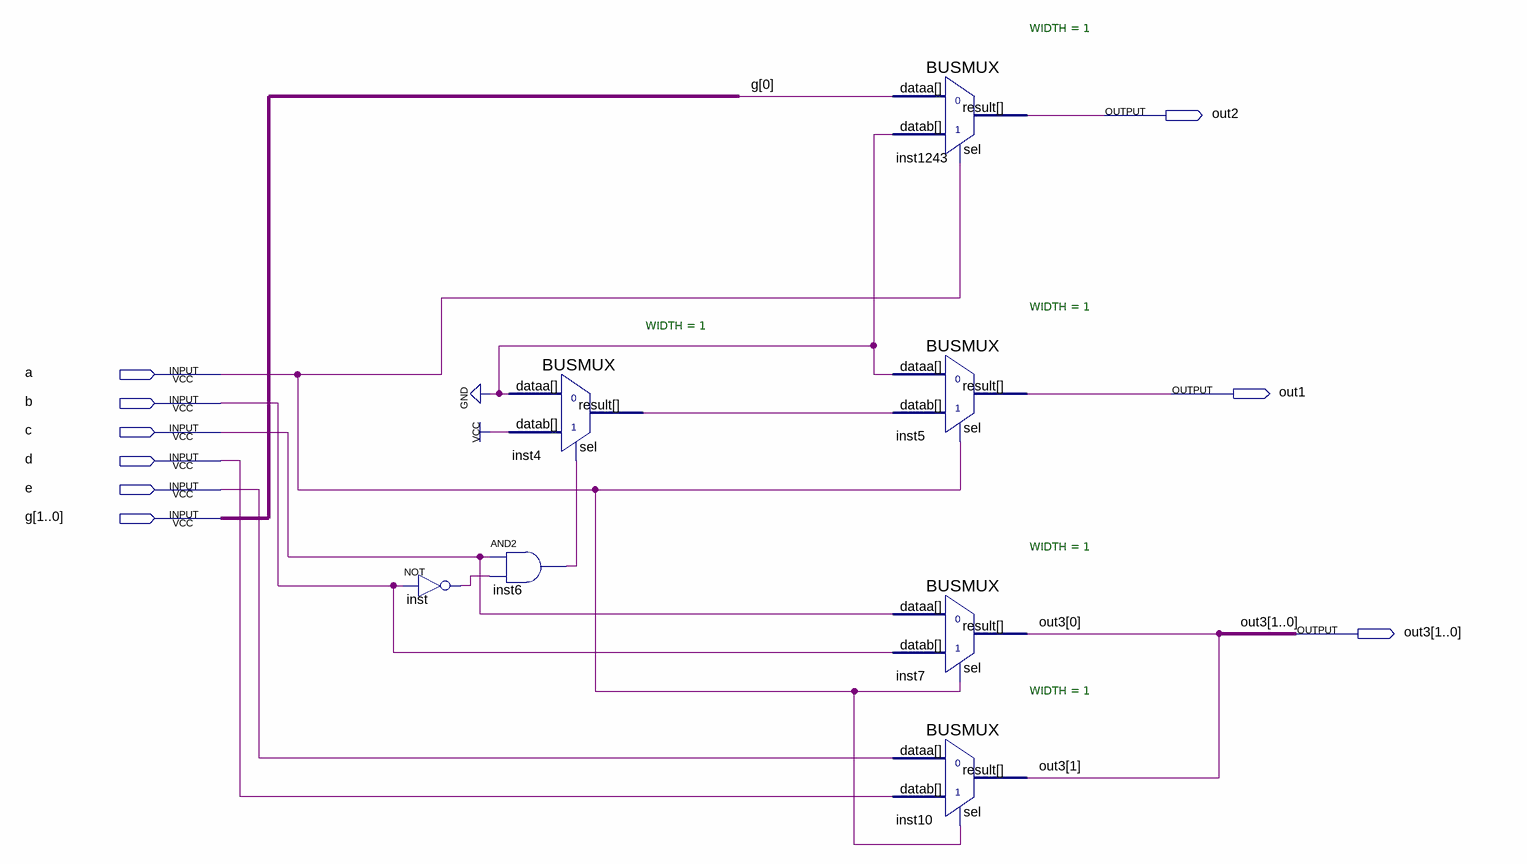
[diagram p0: schematic sheet]
// Quartus schematic Block1.bdf as structural Verilog: 7 symbols, 9 pins
module Block1 (
  input  a,
  input  b,
  input  c,
  input  d,
  input  e,
  input  [1:0] g,
  output out2,
  output out1,
  output [1:0] out3
);

  wire inst4_result, inst6_out, inst_out;

  not inst (inst_out, b);
  BUSMUX #(.WIDTH(1)) inst4 (.datab(1'b1), .sel(inst6_out), .dataa(1'b0), .result(inst4_result));
  and inst6 (inst6_out, c, inst_out);
  BUSMUX #(.WIDTH(1)) inst1243 (.datab(1'b0), .sel(a), .dataa(g[0]), .result(out2));
  BUSMUX #(.WIDTH(1)) inst5 (.datab(inst4_result), .sel(a), .dataa(1'b0), .result(out1));
  BUSMUX #(.WIDTH(1)) inst7 (.datab(b), .sel(a), .dataa(c), .result(out3[0]));
  BUSMUX #(.WIDTH(1)) inst10 (.datab(d), .sel(a), .dataa(e), .result(out3[1]));
endmodule
